# EAGLE design coololu (EAGLE 5.11)
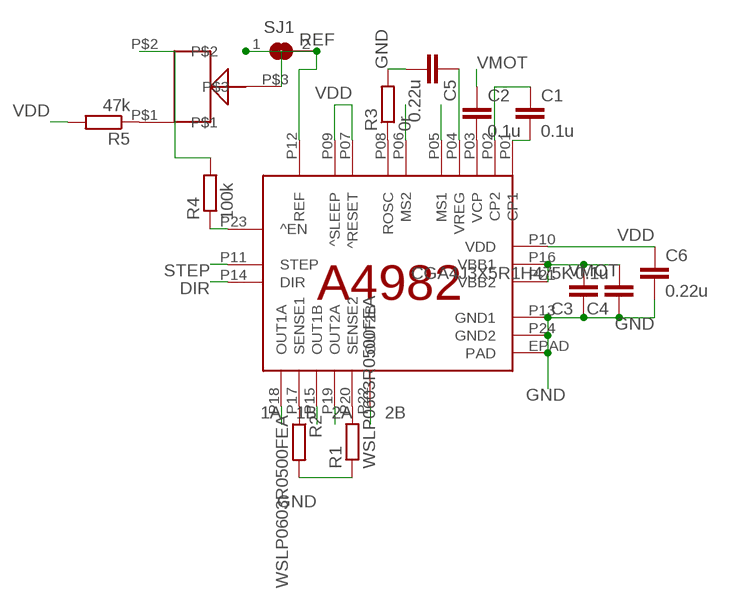
[diagram p0: schematic, sheet 1]

## Parts
C1  0.1u  C-EUC0603K  [C0603K]
C2  0.1u  C-EUC0603K  [C0603K]
C3  CGA4J3X5R1H475K  C-EUC0805K  [C0805K]
C4  0.1u  C-EUC0603K  [C0603K]
C5  0.22u  C-EUC0603K  [C0603K]
C6  0.22u  C-EUC0603  [C0603]
R1  WSLP0603R0500FEA  R-EU_R0603  [R0603]
R2  WSLP0603R0500FEA  R-EU_R0603  [R0603]
R3  0r  R-EU_R0603  [R0603]
R4  100k  R-EU_R0603  [R0603]
R5  47k  R-EU_R0603  [R0603]
SJ1  SJ  [SJ]
U$1  A4982  [ETSSOP24]
U$2  EVM-3YSX50B14  TRIMMER3MM  [TRIMMER3MM]

## Nets
1A: U$1.P18(OUT1A)
1B: U$1.P15(OUT1B)
2A: U$1.P19(OUT2A)
2B: U$1.P22(OUT2B)
DIR: U$1.P14(DIR)
EN: R4.1 U$1.P23(^EN)
GND: C3.1 C4.1 C5.2 C6.2 R1.1 R2.2 R3.2 R4.2 U$1.EPAD(PAD) U$1.P13(GND1) U$1.P24(GND2) U$2.P$2
MS1: U$1.P05(MS1)
MS2: U$1.P06(MS2)
N$1: C2.2 U$1.P03(VCP)
N$2: C5.1 U$1.P04(VREG)
N$3: R3.1 U$1.P08(ROSC)
N$4: R5.1 U$2.P$1
N$9: R2.1 U$1.P17(SENSE1)
N$10: R1.2 U$1.P20(SENSE2)
N$17: C1.2 U$1.P01(CP1)
N$18: C1.1 U$1.P02(CP2)
REF: SJ1.1 SJ1.2 U$1.P12(REF) U$2.P$3
STEP: U$1.P11(STEP)
VDD: C6.1 R5.2 U$1.P07(^RESET) U$1.P09(^SLEEP) U$1.P10(VDD)
VMOT: C2.1 C3.2 C4.2 U$1.P16(VBB1) U$1.P21(VBB2)

## Library data of the parts
C1-C6 = rcl:C-EU: CAPACITOR, European symbol
R1-R5 = rcl:R-EU_: RESISTOR, European symbol
SJ1 = jumper:SJ: SMD solder JUMPER
U$1 = untitled:A4982
U$2 = untitled:TRIMMER3MM

## Board
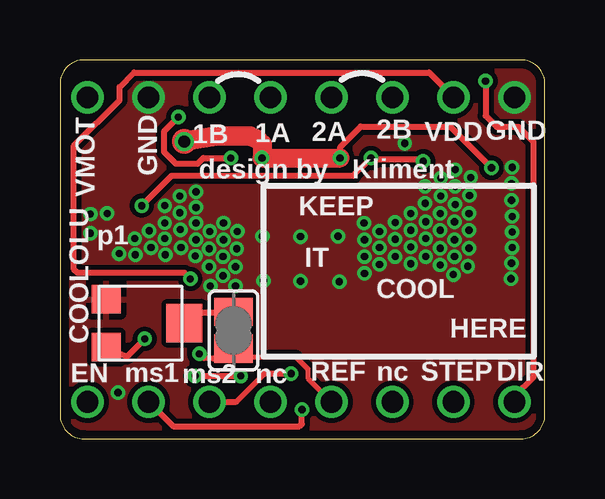
[diagram p1: board, top side]
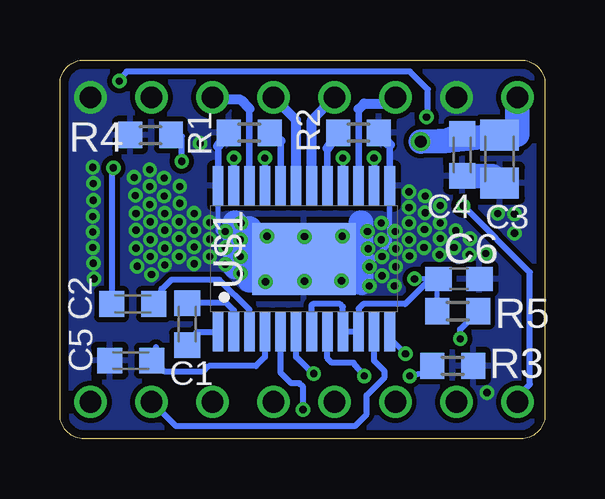
[diagram p2: board, bottom side, seen from below]

Size 20.2 x 15.8 mm. Coordinates in mm from the lower left corner, seen from the top.
Outline: 19.2,0 arc90 20.2,1 20.2,14.8 arc90 19.2,15.8 1,15.8 arc90 0,14.8 0,1 arc90 1,0 19.2,0
Copper layers (1*16): Top 0.035mm / dielectric 1.5mm / Bottom 0.035mm
Design rules "default *": minimum track width 8mil, minimum drill 0.3mm, track to track 8mil, track to pad 8mil, pad to pad 8mil, via to via 8mil, smd to smd 0mil, copper to edge 0.35mm, drill to drill 8mil, minimum pad ring 10mil, minimum via ring 0.15mm, stop-mask expansion 2mil, vias tented up to drill 20mil, thermal gap 10mil

### Footprints (pad centres in the part's own frame; a part is rotated, then mirrored left to right if it is on the bottom)
C0603K = smd 1.05 x 1.08: 1 -0.875,0; 2 0.875,0
C0805K = smd 1.3 x 1.6: 1 -1,0; 2 1,0
C0603 = smd 1.1 x 1: 1 -0.85,0; 2 0.85,0
R0603 = smd 1 x 1.1: 1 -0.85,0; 2 0.85,0
SJ = smd 1.168 x 1.6: 1 -0.762,0; 2 0.762,0
ETSSOP24 = smd 3 x 4.32: EPAD 0,0 | smd 1.635 x 0.44: P01 -3.05,3.575; P02 -3.05,2.925; P03 -3.05,2.275; P04 -3.05,1.625; P05 -3.05,0.975; P06 -3.05,0.325; P07 -3.05,-0.325; P08 -3.05,-0.975; P09 -3.05,-1.625; P10 -3.05,-2.275; P11 -3.05,-2.925; P12 -3.05,-3.575; P13 3.05,-3.575; P14 3.05,-2.925; P15 3.05,-2.275; P16 3.05,-1.625; P17 3.05,-0.975; P18 3.05,-0.325; P19 3.05,0.325; P20 3.05,0.975; P21 3.05,1.625; P22 3.05,2.275; P23 3.05,2.925; P24 3.05,3.575
TRIMMER3MM = smd 1.2 x 1.2: P$1 1,-1.6; P$2 -1,-1.6 | smd 1.6 x 1.5: P$3 0,1.65

### Placement (x,y rotation side)
C1  14.91,4.78 270 bottom
C2  17.18,5.62 0 bottom
C3  1.89,11.67 90 bottom
C4  3.45,11.84 90 bottom
C5  17.26,3.26 180 bottom
C6  3.58,6.67 0 bottom
R1  12.32,12.76 0 bottom
R2  7.76,12.76 0 bottom
R3  3.84,3.04 0 bottom
R4  16.43,12.67 180 bottom
R5  3.63,5.32 180 bottom
SJ1  7.23,4.52 90 top
U$1  10.04,7.5 90 bottom
U$2  3.53,4.82 270 top

### Tracks (layer width: path | path; a pad name or v marks a point on that pad's centre or on a via)
1A  (via drill 0.9)
  Bottom 0.406: U$1.P18 9.72,13.29 v8.77,14.24
1B  (via drill 0.9)
  Bottom 0.28: U$1.P15 7.76,13.75
  Bottom 0.406: v6.23,14.24 6.48,13.99 7.53,13.99 7.76,13.75
2A  (via drill 0.9)
  Bottom 0.406: U$1.P19 10.37,13.29 v11.31,14.24
2B  (via drill 0.9)
  Bottom 0.28: U$1.P22 12.32,13.77
  Bottom 0.406: 12.32,13.77 12.68,14.14 13.45,14.14 v13.85,14.24
DIR  (via drill 0.3, 0.9)
  Top 0.254: v18.93,1.54 18.93,1.78 19.72,2.57 19.72,12.39 19.1,13.01 18.19,13.01 17.73,13.47 v17.73,14.92 | v7.12,11.71 5.97,11.71 5.73,11.47 4.83,11.47 4.33,11.97 4.33,12.82 v4.93,13.42
  Bottom 0.254: U$1.P14 v7.12,11.71 | v17.73,14.92 17.73,15.02 17.43,15.32 5.63,15.32 4.88,14.57 4.88,13.47 v4.93,13.42
EN  (via drill 0.3, 0.9)
  Top 0.254: v12.96,11.71 13,11.67 15.03,11.67 v15.13,11.57 | v12.96,11.71 v12.97,11.71 | v12.96,11.71 12.22,10.97 4.66,10.97 v3.4,9.72
  Bottom 0.254: v1.15,1.54 1.15,1.75 0.63,2.27 0.63,6.95 v3.4,9.72 | R4.1 15.13,12.62 v15.13,11.57
  Bottom 0.28: v12.96,11.71 12.97,10.36 U$1.P23
GND  (via drill 0.3, 0.9)
  Bottom 0.203: U$1.P24 13.62,8.67 11.31,6.37 10.29,6.37 U$1.EPAD 9.91,6.75 7.88,6.75 6.46,8.16 U$1.P13
  Bottom 0.254: 7.66,6.49 7.88,6.75 | 12.33,8.77 12.91,8.79
  Bottom 0.28: U$1.P13 6.46,12.26 | U$1.P24 13.62,12.2
  Bottom 0.406: 6.46,12.26 R2.2 | 13.62,12.2 R1.1
  Bottom 1.016: 7.68,9.02 7.66,9.02 7.66,6.49 | 12.93,9.02 12.91,9.02 12.91,8.79 12.91,7.17 | 12.33,8.77 12.31,8.77 12.31,6.6 | C4.1 2.19,10.96 C3.1
  other vias: 3.69,14.24 18.93,14.24 8.44,8.45 10.02,8.43 11.58,8.45 11.64,6.55 10.02,6.57 8.48,6.59 6.24,8.65 6.79,7.6 12.69,7.6 12.69,6.9 5.01,8.72 3.11,8.35 12.67,9 12.69,8.3 13.32,8.65 17.06,10.15 16.46,9.78 17.04,9.4 13.97,8.32 13.97,7.6 13.32,7.28 13.32,7.97 13.97,9.03 18.79,6.68 18.81,7.32 18.84,7.97 18.84,8.62 18.84,9.28 18.81,9.95 18.81,10.65 18.84,11.32 6.81,9 6.81,8.3 5.64,7.62 6.21,7.93 5.67,8.3 5.67,9 3.14,7.68 6.21,7.18 5.04,7.97 6.79,6.8 6.26,6.38 7.31,6.38 7.31,7.18 7.37,7.93 7.39,8.65 4.37,9 4.37,8.35 4.39,7.68 3.79,7.97 1.96,9.4 3.71,8.67 2.46,7.72 1.27,8.57 14.62,7.3 14.62,8 14.62,8.7 14.62,9.4 15.24,7.6 15.84,7.25 15.24,8.35 15.24,9.05 15.84,7.95 15.84,8.7 15.84,9.4 16.44,7.6 16.44,8.3 16.44,9.05 16.99,7.2 16.39,6.85 17.04,7.95 17.04,8.7 15.22,9.82 15.87,10.12 15.22,10.53 16.46,10.53 15.87,10.88 17.11,10.9 16.46,11.22 14.37,12.32 1.27,9.38 4.99,9.42 5.67,9.65 4.37,9.72 4.99,10.12 5.67,10.3 2.42,1.93
  pour Top: -0.72,15.97 21.83,15.97 21.83,-0.18 -0.72,-0.18 -0.72,15.92
  pour Bottom: -1.27,15.92 21.73,15.92 21.73,-0.08 -1.32,-0.08 -1.32,15.82
MS1  (via drill 0.3, 0.9)
  Top 0.254: v10.08,1.22 10.08,0.62 9.98,0.52 4.71,0.52 v3.69,1.54
  Bottom 0.254: U$1.P05 11.02,2.75 10.58,2.32 10.23,2.32 10.08,2.17 v10.08,1.22
MS2  (via drill 0.3, 0.9)
  Top 0.203: 7.35,1.54 8.53,2.72
  Top 0.254: v6.23,1.54 7.35,1.54 | 8.53,2.72 v9.63,2.72
  Bottom 0.254: U$1.P06 10.37,3.4 9.68,2.72 v9.63,2.72
MS3  (via drill 0.9)
  other vias: 8.77,1.54
N$1
  Bottom 0.254: U$1.P03 12.32,5.38 13.56,6.63 15.56,6.63 15.94,6.25 15.97,6.25 C2.2
N$2
  Bottom 0.254: U$1.P04 11.67,3.4 12.04,3.03 14,3.03 14.24,2.79 15.84,2.79 16.2,3.15 16.2,3.83 C5.1
N$3  (via drill 0.3)
  Top 0.254: v5.63,2.62 v7.53,2.62
  Bottom 0.254: U$1.P08 9.07,3.35 8.88,3.17 7.98,3.17 v7.53,2.62 | R3.1 4.39,2.86 v5.63,2.62
N$4  (via drill 0.3)
  Top 0.254: U$2.P$1 2.78,3.42 v3.53,4.17
  Bottom 0.254: v3.53,4.17 3.53,4.57 R5.1
N$5  (via drill 0.9)
  other vias: 13.85,1.54
N$9
  Bottom 0.28: 9.07,12.1 U$1.P17
  Bottom 0.406: R2.1 9.07,12.1
N$10
  Bottom 0.28: 11.02,12.42 U$1.P20
  Bottom 0.406: R1.2 11.02,12.42
N$17
  Bottom 0.254: U$1.P01 14.5,4.45 C1.2
N$18
  Bottom 0.203: U$1.P02 12.97,4.59
  Bottom 0.254: 12.97,4.59 12.97,5.36 13.28,5.67 14.7,5.67 C1.1
REF  (via drill 0.3, 0.9)
  Top 0.203: SJ1.2 SJ1.1 | SJ1.1 6.87,4.06 6.63,3.47 | v11.31,1.54 10.33,2.52 10.33,2.92 9.83,3.42 7.57,3.42 SJ1.1 | 6.41,3.35 6,3.35 v5.8,3.54 | U$2.P$3 5.63,5.27
  Top 0.254: v11.31,1.54 11.36,1.59 | 6.63,3.47 6.41,3.35 | 5.63,5.27 7.22,5.27 SJ1.2
  Bottom 0.203: U$1.P12 6.46,4.21 v5.8,3.54
STEP  (via drill 0.9)
  Bottom 0.254: v16.39,1.54 15.37,0.52 7.93,0.52 7.43,1.02 7.43,1.82 6.68,2.57 6.68,2.82 7.12,3.25 U$1.P11
VDD  (via drill 0.3, 0.9)
  Top 0.203: v5.43,6.67 5.18,6.92
  Top 0.254: v16.39,14.24 16.39,14.26 15.38,15.27 3.08,15.27 2.48,14.67 2.48,14.12 0.58,12.22 0.58,7.07 0.73,6.92 5.18,6.92
  Bottom 0.203: R5.2 4.48,6.62 C6.1 | 4.78,6.67 v5.43,6.67
  Bottom 0.254: 4.13,6.37 C6.1 4.68,6.77 4.78,6.67 5.83,5.62 7.58,5.62 7.76,5.44 U$1.P10 U$1.P09 8.42,5.51 8.53,5.62 9.68,5.62 9.73,5.57 9.73,4.47 U$1.P07
VMOT  (via drill 0.3, 0.3 pad 0.2, 0.5, 0.9)
  Top 0.254: v11.67,11.71 v11.68,11.71 11.68,12.17 12.53,13.02 16.26,13.02 v17.98,11.3
  Top 0.8: v11.67,11.71 v8.42,11.71 8.42,12.28
  Top 0.813: 5.18,12.42 6.48,12.62 7.93,12.62 8.23,12.47 8.42,12.28
  Top 1.016: v5.18,12.4 5.18,12.42
  Bottom 0.203: U$1.P16 v8.42,11.71
  Bottom 0.254: U$1.P21 v11.67,11.71 | C2.1 18.05,11.22 v17.98,11.3
  Bottom 1.016: v1.15,14.24 1.15,12.68 1.57,12.61 2.26,12.61 C3.2 4.18,12.41 | 4.18,12.41 C4.2 | 4.18,12.41 4.41,12.41 v5.18,12.4

### Text on the board
tPlace: VMOT | GND | 1B | 1A | 2A | 2B | VDD | GND | design by | Kliment | p1 | KEEP | IT | COOL | COOLOLU | HERE | EN | ms1 | ms2 | nc | REF | nc | STEP | DIR